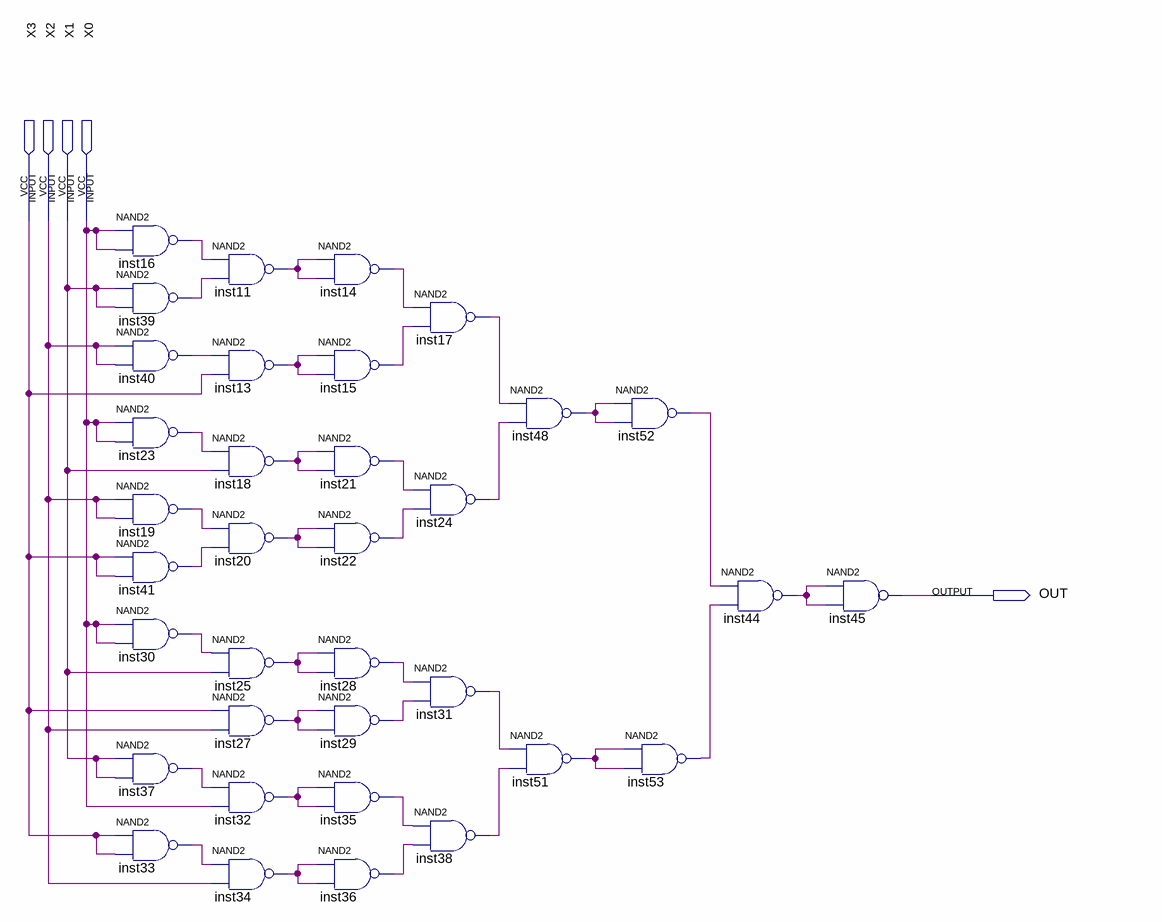
[diagram p0: schematic sheet]
// Quartus schematic D.bdf as structural Verilog: 35 symbols, 5 pins
module D (
  input  X3,
  input  X2,
  input  X1,
  input  X0,
  output OUT
);

  wire inst11_out, inst13_out, inst14_out, inst15_out, inst16_out, inst17_out, inst18_out, inst19_out,
       inst20_out, inst21_out, inst22_out, inst23_out, inst24_out, inst25_out, inst27_out, inst28_out,
       inst29_out, inst30_out, inst31_out, inst32_out, inst33_out, inst34_out, inst35_out, inst36_out,
       inst37_out, inst38_out, inst39_out, inst40_out, inst41_out, inst44_out, inst48_out, inst51_out,
       inst52_out, inst53_out;

  nand inst16 (inst16_out, X0, X0);
  nand inst39 (inst39_out, X1, X1);
  nand inst40 (inst40_out, X2, X2);
  nand inst23 (inst23_out, X0, X0);
  nand inst19 (inst19_out, X2, X2);
  nand inst41 (inst41_out, X3, X3);
  nand inst30 (inst30_out, X0, X0);
  nand inst37 (inst37_out, X1, X1);
  nand inst33 (inst33_out, X3, X3);
  nand inst11 (inst11_out, inst16_out, inst39_out);
  nand inst13 (inst13_out, inst40_out, X3);
  nand inst18 (inst18_out, inst23_out, X1);
  nand inst20 (inst20_out, inst19_out, inst41_out);
  nand inst25 (inst25_out, inst30_out, X1);
  nand inst27 (inst27_out, X3, X2);
  nand inst32 (inst32_out, inst37_out, X0);
  nand inst34 (inst34_out, inst33_out, X2);
  nand inst14 (inst14_out, inst11_out, inst11_out);
  nand inst15 (inst15_out, inst13_out, inst13_out);
  nand inst21 (inst21_out, inst18_out, inst18_out);
  nand inst22 (inst22_out, inst20_out, inst20_out);
  nand inst28 (inst28_out, inst25_out, inst25_out);
  nand inst29 (inst29_out, inst27_out, inst27_out);
  nand inst35 (inst35_out, inst32_out, inst32_out);
  nand inst36 (inst36_out, inst34_out, inst34_out);
  nand inst17 (inst17_out, inst14_out, inst15_out);
  nand inst24 (inst24_out, inst21_out, inst22_out);
  nand inst31 (inst31_out, inst28_out, inst29_out);
  nand inst38 (inst38_out, inst35_out, inst36_out);
  nand inst48 (inst48_out, inst17_out, inst24_out);
  nand inst51 (inst51_out, inst31_out, inst38_out);
  nand inst52 (inst52_out, inst48_out, inst48_out);
  nand inst53 (inst53_out, inst51_out, inst51_out);
  nand inst44 (inst44_out, inst52_out, inst53_out);
  nand inst45 (OUT, inst44_out, inst44_out);
endmodule
